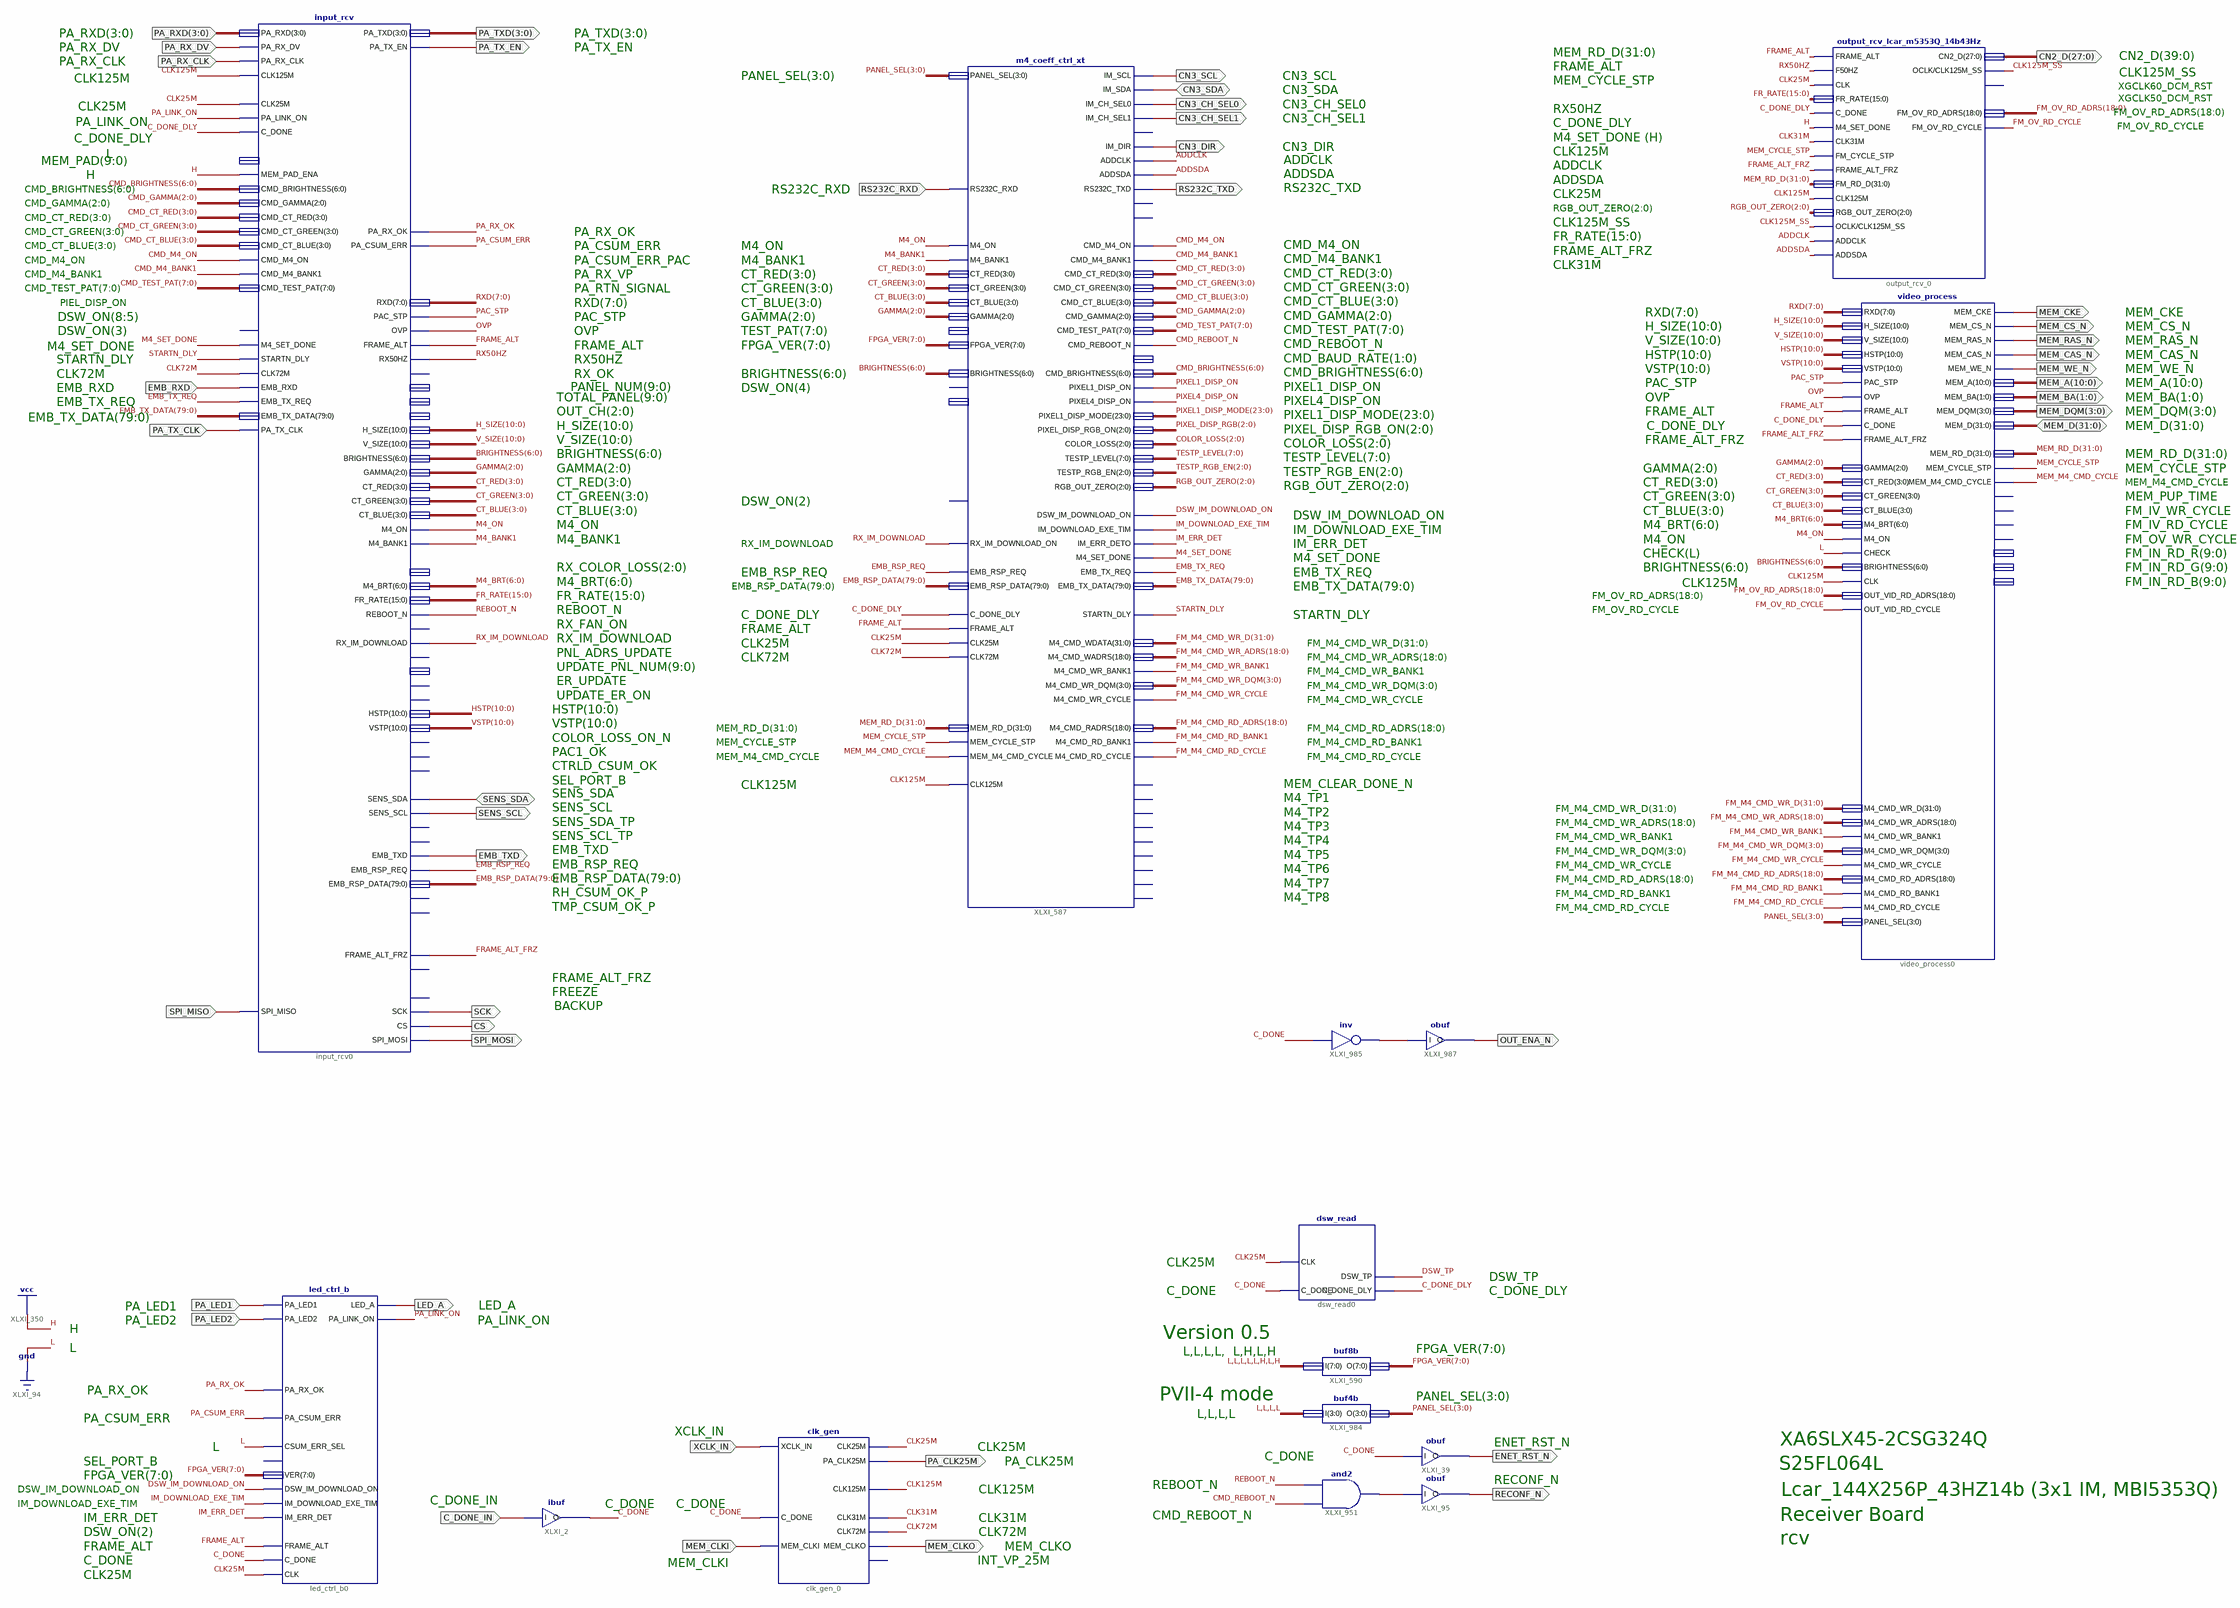
[diagram p0: schematic sheet 1]
// Xilinx ISE schematic rcv.sch (aspartan6) as structural Verilog: 15 symbols, 42 ports
module rcv (
  input  RS232C_RXD,
  input  MEM_CLKI,
  input  XCLK_IN,
  input  PA_LED1,
  input  PA_LED2,
  input  C_DONE_IN,
  input  PA_RX_DV,
  input  [3:0] PA_RXD,
  input  PA_RX_CLK,
  input  EMB_RXD,
  input  PA_TX_CLK,
  input  SPI_MISO,
  inout  CN3_SDA,
  inout  [31:0] MEM_D,
  inout  SENS_SDA,
  output CN3_CH_SEL1,
  output CN3_CH_SEL0,
  output CN3_SCL,
  output RS232C_TXD,
  output MEM_CS_N,
  output [3:0] MEM_DQM,
  output MEM_RAS_N,
  output MEM_CAS_N,
  output MEM_WE_N,
  output MEM_CKE,
  output [10:0] MEM_A,
  output [1:0] MEM_BA,
  output PA_CLK25M,
  output MEM_CLKO,
  output RECONF_N,
  output ENET_RST_N,
  output LED_A,
  output CN3_DIR,
  output [27:0] CN2_D,
  output [3:0] PA_TXD,
  output PA_TX_EN,
  output SENS_SCL,
  output EMB_TXD,
  output SCK,
  output CS,
  output SPI_MOSI,
  output OUT_ENA_N
);

  wire ADDCLK, ADDSDA, C_DONE, C_DONE_DLY, CLK25M, CLK31M, CLK72M, CLK125M, CLK125M_SS, CMD_M4_BANK1,
       CMD_M4_ON, CMD_REBOOT_N, DSW_IM_DOWNLOAD_ON, DSW_TP, EMB_RSP_REQ, EMB_TX_REQ, FM_M4_CMD_RD_BANK1,
       FM_M4_CMD_RD_CYCLE, FM_M4_CMD_WR_BANK1, FM_M4_CMD_WR_CYCLE, FM_OV_RD_CYCLE, FRAME_ALT, FRAME_ALT_FRZ,
       IM_DOWNLOAD_EXE_TIM, IM_ERR_DET, M4_BANK1, M4_ON, M4_SET_DONE, MEM_CYCLE_STP, MEM_M4_CMD_CYCLE, OVP,
       PA_CSUM_ERR, PA_LINK_ON, PA_RX_OK, PAC_STP, PIXEL1_DISP_ON, PIXEL4_DISP_ON, REBOOT_N, RX50HZ,
       RX_IM_DOWNLOAD, STARTN_DLY, XLXN_475, XLXN_477;
  wire [2:0] CMD_GAMMA, COLOR_LOSS, GAMMA, PIXEL_DISP_RGB, RGB_OUT_ZERO, TESTP_RGB_EN;
  wire [3:0] CMD_CT_BLUE, CMD_CT_GREEN, CMD_CT_RED, CT_BLUE, CT_GREEN, CT_RED, FM_M4_CMD_WR_DQM, PANEL_SEL;
  wire [6:0] BRIGHTNESS, CMD_BRIGHTNESS, M4_BRT;
  wire [7:0] CMD_TEST_PAT, FPGA_VER, RXD, TESTP_LEVEL;
  wire [10:0] H_SIZE, HSTP, V_SIZE, VSTP;
  wire [15:0] FR_RATE;
  wire [18:0] FM_M4_CMD_RD_ADRS, FM_M4_CMD_WR_ADRS, FM_OV_RD_ADRS;
  wire [23:0] PIXEL1_DISP_MODE;
  wire [31:0] FM_M4_CMD_WR_D, MEM_RD_D;
  wire [79:0] EMB_RSP_DATA, EMB_TX_DATA;

  clk_gen clk_gen_0 (
    .XCLK_IN(XCLK_IN), .C_DONE(C_DONE), .MEM_CLKI(MEM_CLKI), .CLK25M(CLK25M), .PA_CLK25M(PA_CLK25M),
    .CLK31M(CLK31M), .CLK125M(CLK125M), .MEM_CLKO(MEM_CLKO), .CLK72M(CLK72M));  // open: VP
  obuf XLXI_95 (.I(XLXN_475), .O(RECONF_N));
  and XLXI_951 (XLXN_475, CMD_REBOOT_N, REBOOT_N);
  obuf XLXI_39 (.I(C_DONE), .O(ENET_RST_N));
  buf8b XLXI_590 (.I(8'b00000101), .O(FPGA_VER));
  dsw_read dsw_read0 (.CLK(CLK25M), .C_DONE(C_DONE), .DSW_TP(DSW_TP), .C_DONE_DLY(C_DONE_DLY));
  ibuf XLXI_2 (.I(C_DONE_IN), .O(C_DONE));
  video_process video_process0 (
    .OVP(OVP), .CLK(CLK125M), .FRAME_ALT(FRAME_ALT), .RXD(RXD), .H_SIZE(H_SIZE), .V_SIZE(V_SIZE),
    .HSTP(HSTP), .VSTP(VSTP), .PAC_STP(PAC_STP), .C_DONE(C_DONE_DLY), .OUT_VID_RD_ADRS(FM_OV_RD_ADRS),
    .OUT_VID_RD_CYCLE(FM_OV_RD_CYCLE), .GAMMA(GAMMA), .CT_RED(CT_RED), .CT_GREEN(CT_GREEN),
    .CT_BLUE(CT_BLUE), .M4_BRT(M4_BRT), .M4_ON(M4_ON), .CHECK(1'b0), .M4_CMD_RD_CYCLE(FM_M4_CMD_RD_CYCLE),
    .M4_CMD_RD_BANK1(FM_M4_CMD_RD_BANK1), .M4_CMD_RD_ADRS(FM_M4_CMD_RD_ADRS),
    .M4_CMD_WR_CYCLE(FM_M4_CMD_WR_CYCLE), .M4_CMD_WR_DQM(FM_M4_CMD_WR_DQM),
    .M4_CMD_WR_BANK1(FM_M4_CMD_WR_BANK1), .M4_CMD_WR_ADRS(FM_M4_CMD_WR_ADRS), .M4_CMD_WR_D(FM_M4_CMD_WR_D),
    .FRAME_ALT_FRZ(FRAME_ALT_FRZ), .BRIGHTNESS(BRIGHTNESS), .MEM_D(MEM_D), .MEM_CKE(MEM_CKE),
    .MEM_CS_N(MEM_CS_N), .MEM_RAS_N(MEM_RAS_N), .MEM_CAS_N(MEM_CAS_N), .MEM_WE_N(MEM_WE_N),
    .MEM_DQM(MEM_DQM), .MEM_RD_D(MEM_RD_D), .MEM_BA(MEM_BA), .MEM_A(MEM_A),
    .MEM_M4_CMD_CYCLE(MEM_M4_CMD_CYCLE), .MEM_CYCLE_STP(MEM_CYCLE_STP), .PANEL_SEL(PANEL_SEL));  // open: PUP_TIME, FM_IV_WR_CYCLE, FM_IV_RD_CYCLE, FM_OV_WR_CYCLE, FM_IN_RD_G, FM_IN_RD_R, FM_IN_RD_B
  buf4b XLXI_984 (.I(4'b0000), .O(PANEL_SEL));
  m4_coeff_ctrl_xt XLXI_587 (
    .FRAME_ALT(FRAME_ALT), .CLK25M(CLK25M), .EMB_RSP_REQ(EMB_RSP_REQ), .EMB_RSP_DATA(EMB_RSP_DATA),
    .CLK72M(CLK72M), .RX_IM_DOWNLOAD_ON(RX_IM_DOWNLOAD), .M4_ON(M4_ON), .M4_BANK1(M4_BANK1), .CT_RED(CT_RED),
    .CT_GREEN(CT_GREEN), .CT_BLUE(CT_BLUE), .GAMMA(GAMMA), .FPGA_VER(FPGA_VER), .BRIGHTNESS(BRIGHTNESS),
    .RS232C_RXD(RS232C_RXD), .C_DONE_DLY(C_DONE_DLY), .PANEL_SEL(PANEL_SEL),
    .MEM_M4_CMD_CYCLE(MEM_M4_CMD_CYCLE), .MEM_CYCLE_STP(MEM_CYCLE_STP), .MEM_RD_D(MEM_RD_D),
    .CLK125M(CLK125M), .IM_SDA(CN3_SDA), .M4_SET_DONE(M4_SET_DONE), .DSW_IM_DOWNLOAD_ON(DSW_IM_DOWNLOAD_ON),
    .STARTN_DLY(STARTN_DLY), .RS232C_TXD(RS232C_TXD), .CMD_M4_ON(CMD_M4_ON), .CMD_M4_BANK1(CMD_M4_BANK1),
    .CMD_CT_RED(CMD_CT_RED), .CMD_CT_GREEN(CMD_CT_GREEN), .CMD_CT_BLUE(CMD_CT_BLUE), .CMD_GAMMA(CMD_GAMMA),
    .CMD_TEST_PAT(CMD_TEST_PAT), .CMD_REBOOT_N(CMD_REBOOT_N), .CMD_BRIGHTNESS(CMD_BRIGHTNESS),
    .PIXEL1_DISP_ON(PIXEL1_DISP_ON), .PIXEL4_DISP_ON(PIXEL4_DISP_ON), .PIXEL1_DISP_MODE(PIXEL1_DISP_MODE),
    .PIXEL_DISP_RGB_ON(PIXEL_DISP_RGB), .COLOR_LOSS(COLOR_LOSS), .TESTP_LEVEL(TESTP_LEVEL),
    .TESTP_RGB_EN(TESTP_RGB_EN), .RGB_OUT_ZERO(RGB_OUT_ZERO), .IM_DOWNLOAD_EXE_TIM(IM_DOWNLOAD_EXE_TIM),
    .EMB_TX_REQ(EMB_TX_REQ), .EMB_TX_DATA(EMB_TX_DATA), .IM_SCL(CN3_SCL), .IM_CH_SEL0(CN3_CH_SEL0),
    .IM_CH_SEL1(CN3_CH_SEL1), .M4_CMD_WR_CYCLE(FM_M4_CMD_WR_CYCLE), .M4_CMD_WDATA(FM_M4_CMD_WR_D),
    .M4_CMD_WADRS(FM_M4_CMD_WR_ADRS), .M4_CMD_WR_BANK1(FM_M4_CMD_WR_BANK1), .M4_CMD_WR_DQM(FM_M4_CMD_WR_DQM),
    .M4_CMD_RADRS(FM_M4_CMD_RD_ADRS), .M4_CMD_RD_BANK1(FM_M4_CMD_RD_BANK1),
    .M4_CMD_RD_CYCLE(FM_M4_CMD_RD_CYCLE), .IM_ERR_DETO(IM_ERR_DET), .ADDSDA(ADDSDA), .ADDCLK(ADDCLK),
    .IM_DIR(CN3_DIR));  // open: DSW_IM_DOWNLOAD_REQ, TEST_PAT, DSW_LOSS_BRT100, MEM_COLOR_LOSS, RS232C_RXD_A, RS232C_TXD_A, CMD_BAUD_RATE, MEM_CLEAR_DONE_N, TP1, TP2, TP3, TP6, TP7, TP8, TP4, TP5, IM_CH_SEL2
  led_ctrl_b led_ctrl_b0 (
    .DSW_IM_DOWNLOAD_ON(DSW_IM_DOWNLOAD_ON), .IM_DOWNLOAD_EXE_TIM(IM_DOWNLOAD_EXE_TIM),
    .IM_ERR_DET(IM_ERR_DET), .CLK(CLK25M), .C_DONE(C_DONE), .FRAME_ALT(FRAME_ALT), .VER(FPGA_VER),
    .CSUM_ERR_SEL(1'b0), .PA_RX_OK(PA_RX_OK), .PA_CSUM_ERR(PA_CSUM_ERR), .PA_LED1(PA_LED1),
    .PA_LED2(PA_LED2), .PA_LINK_ON(PA_LINK_ON), .LED_A(LED_A));  // open: SEL_PORT_B
  output_rcv_lcar_m5353Q_14b43Hz output_rcv_0 (
    .CLK(CLK25M), .ADDCLK(ADDCLK), .ADDSDA(ADDSDA), .FRAME_ALT(FRAME_ALT), .F50HZ(RX50HZ),
    .C_DONE(C_DONE_DLY), .M4_SET_DONE(1'b1), .CLK125M(CLK125M), .FM_CYCLE_STP(MEM_CYCLE_STP),
    .FM_RD_D(MEM_RD_D), .RGB_OUT_ZERO(RGB_OUT_ZERO), .OCLK(CLK125M_SS), .FR_RATE(FR_RATE),
    .FRAME_ALT_FRZ(FRAME_ALT_FRZ), .CLK31M(CLK31M), .CN2_D(CN2_D), .FM_OV_RD_ADRS(FM_OV_RD_ADRS),
    .FM_OV_RD_CYCLE(FM_OV_RD_CYCLE), .CLK125M_SS(CLK125M_SS));  // open: XGCLK60_DCM_RST
  input_rcv input_rcv0 (
    .CLK125M(CLK125M), .PA_LINK_ON(PA_LINK_ON), .C_DONE(C_DONE_DLY), .PA_RX_DV(PA_RX_DV), .CLK25M(CLK25M),
    .EMB_RXD(EMB_RXD), .EMB_TX_REQ(EMB_TX_REQ), .EMB_TX_DATA(EMB_TX_DATA), .STARTN_DLY(STARTN_DLY),
    .CLK72M(CLK72M), .CMD_BRIGHTNESS(CMD_BRIGHTNESS), .MEM_PAD_ENA(1'b1), .CMD_GAMMA(CMD_GAMMA),
    .CMD_CT_RED(CMD_CT_RED), .CMD_CT_GREEN(CMD_CT_GREEN), .CMD_CT_BLUE(CMD_CT_BLUE), .CMD_M4_ON(CMD_M4_ON),
    .CMD_M4_BANK1(CMD_M4_BANK1), .CMD_TEST_PAT(CMD_TEST_PAT), .M4_SET_DONE(M4_SET_DONE), .PA_RXD(PA_RXD),
    .PA_RX_CLK(PA_RX_CLK), .PA_TX_CLK(PA_TX_CLK), .SPI_MISO(SPI_MISO), .SENS_SDA(SENS_SDA),
    .PA_RX_OK(PA_RX_OK), .OVP(OVP), .FRAME_ALT(FRAME_ALT), .PA_TXD(PA_TXD), .PA_TX_EN(PA_TX_EN),
    .SENS_SCL(SENS_SCL), .EMB_TXD(EMB_TXD), .EMB_RSP_REQ(EMB_RSP_REQ), .EMB_RSP_DATA(EMB_RSP_DATA),
    .RXD(RXD), .PAC_STP(PAC_STP), .REBOOT_N(REBOOT_N), .RX_IM_DOWNLOAD(RX_IM_DOWNLOAD), .HSTP(HSTP),
    .VSTP(VSTP), .RX50HZ(RX50HZ), .H_SIZE(H_SIZE), .V_SIZE(V_SIZE), .BRIGHTNESS(BRIGHTNESS), .GAMMA(GAMMA),
    .CT_RED(CT_RED), .CT_GREEN(CT_GREEN), .CT_BLUE(CT_BLUE), .M4_ON(M4_ON), .M4_BANK1(M4_BANK1),
    .M4_BRT(M4_BRT), .FR_RATE(FR_RATE), .FRAME_ALT_FRZ(FRAME_ALT_FRZ), .PA_CSUM_ERR(PA_CSUM_ERR), .SCK(SCK),
    .CS(CS), .SPI_MOSI(SPI_MOSI));  // open: MEM_PAD, DSW_PAD_UPDATE, PANEL_NUM, RX_FAN_ON, SENS_SCL_TP, SENS_SDA_TP, TMP_CSUM_OK_P, RH_CSUM_OK_P, UPDATE_PNL_NUM, PNL_ADRS_UPDATE, ER_UPDATE, UPDATE_ER_ON, COLOR_LOSS_ON_N, RX_OK, PAC1_OK, CTRLD_CSUM_OK, TOTAL_PANEL, OUT_CH, COLOR_LOSS, FREEZE, L
  not XLXI_985 (XLXN_477, C_DONE);
  obuf XLXI_987 (.I(XLXN_477), .O(OUT_ENA_N));

  // Notes on the sheet:
  //   PA_RXD(3:0)
  //   PA_TXD(3:0)
  //   PA_RX_DV
  //   PA_TX_EN
  //   MEM_RD_D(31:0)
  //   CN2_D(39:0)
  //   PA_RX_CLK
  //   FRAME_ALT
  //   CLK125M_SS
  //   PANEL_SEL(3:0)
  //   CN3_SCL
  //   CLK125M
  //   MEM_CYCLE_STP
  //   XGCLK60_DCM_RST
  //   CN3_SDA
  //   XGCLK50_DCM_RST
  //   CN3_CH_SEL0
  //   CLK25M
  //   RX50HZ
  //   FM_OV_RD_ADRS(18:0)
  //   CN3_CH_SEL1
  //   PA_LINK_ON
  //   C_DONE_DLY
  //   FM_OV_RD_CYCLE
  //   M4_SET_DONE (H)
  //   C_DONE_DLY
  //   CN3_DIR
  //   CLK125M
  //   L
  //   ADDCLK
  //   MEM_PAD(9:0)
  //   ADDCLK
  //   ADDSDA
  //   H
  //   ADDSDA
  //   RS232C_TXD
  //   CMD_BRIGHTNESS(6:0)
  //   RS232C_RXD
  //   CLK25M
  //   CMD_GAMMA(2:0)
  //   RGB_OUT_ZERO(2:0)
  //   CMD_CT_RED(3:0)
  //   CLK125M_SS
  //   CMD_CT_GREEN(3:0)
  //   PA_RX_OK
  //   FR_RATE(15:0)
  //   CMD_M4_ON
  //   CMD_CT_BLUE(3:0)
  //   PA_CSUM_ERR
  //   M4_ON
  //   FRAME_ALT_FRZ
  //   CMD_M4_BANK1
  //   CMD_M4_ON
  //   PA_CSUM_ERR_PAC
  //   M4_BANK1
  //   CLK31M
  //   CMD_CT_RED(3:0)
  //   CMD_M4_BANK1
  //   PA_RX_VP
  //   CT_RED(3:0)
  //   CMD_CT_GREEN(3:0)
  //   CMD_TEST_PAT(7:0)
  //   PA_RTN_SIGNAL
  //   CT_GREEN(3:0)
  //   CMD_CT_BLUE(3:0)
  //   PIEL_DISP_ON
  //   RXD(7:0)
  //   CT_BLUE(3:0)
  //   RXD(7:0)
  //   MEM_CKE
  //   CMD_GAMMA(2:0)
  //   DSW_ON(8:5)
  //   PAC_STP
  //   GAMMA(2:0)
  //   H_SIZE(10:0)
  //   MEM_CS_N
  //   CMD_TEST_PAT(7:0)
  //   DSW_ON(3)
  //   OVP
  //   TEST_PAT(7:0)
  //   V_SIZE(10:0)
  //   MEM_RAS_N
  //   CMD_REBOOT_N
  //   FRAME_ALT
  //   FPGA_VER(7:0)
  //   M4_SET_DONE
  //   HSTP(10:0)
  //   MEM_CAS_N
  //   CMD_BAUD_RATE(1:0)
  //   STARTN_DLY
  //   RX50HZ
  //   VSTP(10:0)
  //   MEM_WE_N
  //   CMD_BRIGHTNESS(6:0)
  //   CLK72M
  //   RX_OK
  //   BRIGHTNESS(6:0)
  //   PAC_STP
  //   MEM_A(10:0)
  //   PANEL_NUM(9:0)
  //   PIXEL1_DISP_ON
  //   EMB_RXD
  //   DSW_ON(4)
  //   TOTAL_PANEL(9:0)
  //   OVP
  //   MEM_BA(1:0)
  //   PIXEL4_DISP_ON
  //   EMB_TX_REQ
  //   OUT_CH(2:0)
  //   FRAME_ALT
  //   MEM_DQM(3:0)
  //   PIXEL1_DISP_MODE(23:0)
  //   EMB_TX_DATA(79:0)
  //   H_SIZE(10:0)
  //   C_DONE_DLY
  //   MEM_D(31:0)
  //   PIXEL_DISP_RGB_ON(2:0)
  //   V_SIZE(10:0)
  //   FRAME_ALT_FRZ
  //   COLOR_LOSS(2:0)
  //   BRIGHTNESS(6:0)
  //   MEM_RD_D(31:0)
  //   TESTP_LEVEL(7:0)
  //   GAMMA(2:0)
  //   GAMMA(2:0)
  //   MEM_CYCLE_STP
  //   TESTP_RGB_EN(2:0)
  //   CT_RED(3:0)
  //   CT_RED(3:0)
  //   MEM_M4_CMD_CYCLE
  //   RGB_OUT_ZERO(2:0)
  //   CT_GREEN(3:0)
  //   CT_GREEN(3:0)
  //   MEM_PUP_TIME
  //   DSW_ON(2)
  //   CT_BLUE(3:0)
  //   CT_BLUE(3:0)
  //   FM_IV_WR_CYCLE
  //   DSW_IM_DOWNLOAD_ON
  //   M4_ON
  //   M4_BRT(6:0)
  //   FM_IV_RD_CYCLE
  //   IM_DOWNLOAD_EXE_TIM
  //   M4_BANK1
  //   M4_ON
  //   FM_OV_WR_CYCLE
  //   RX_IM_DOWNLOAD
  //   IM_ERR_DET
  //   CHECK(L)
  //   FM_IN_RD_R(9:0)
  //   M4_SET_DONE
  //   RX_COLOR_LOSS(2:0)
  //   BRIGHTNESS(6:0)
  //   FM_IN_RD_G(9:0)
  //   EMB_RSP_REQ
  //   EMB_TX_REQ
  //   M4_BRT(6:0)
  //   FM_IN_RD_B(9:0)
  //   CLK125M
  //   EMB_RSP_DATA(79:0)
  //   EMB_TX_DATA(79:0)
  //   FR_RATE(15:0)
  //   FM_OV_RD_ADRS(18:0)
  //   REBOOT_N
  //   FM_OV_RD_CYCLE
  //   C_DONE_DLY
  //   STARTN_DLY
  //   RX_FAN_ON
  //   FRAME_ALT
  //   RX_IM_DOWNLOAD
  //   CLK25M
  //   FM_M4_CMD_WR_D(31:0)
  //   PNL_ADRS_UPDATE
  //   CLK72M
  //   FM_M4_CMD_WR_ADRS(18:0)
  //   UPDATE_PNL_NUM(9:0)
  //   FM_M4_CMD_WR_BANK1
  //   ER_UPDATE
  //   FM_M4_CMD_WR_DQM(3:0)
  //   UPDATE_ER_ON
  //   FM_M4_CMD_WR_CYCLE
  //   HSTP(10:0)
  //   VSTP(10:0)
  //   MEM_RD_D(31:0)
  //   FM_M4_CMD_RD_ADRS(18:0)
  //   COLOR_LOSS_ON_N
  //   MEM_CYCLE_STP
  //   FM_M4_CMD_RD_BANK1
  //   PAC1_OK
  //   MEM_M4_CMD_CYCLE
  //   FM_M4_CMD_RD_CYCLE
  //   CTRLD_CSUM_OK
  //   SEL_PORT_B
  //   MEM_CLEAR_DONE_N
  //   CLK125M
  //   SENS_SDA
  //   M4_TP1
  //   SENS_SCL
  //   FM_M4_CMD_WR_D(31:0)
  //   M4_TP2
  //   SENS_SDA_TP
  //   FM_M4_CMD_WR_ADRS(18:0)
  //   M4_TP3
  //   SENS_SCL_TP
  //   FM_M4_CMD_WR_BANK1
  //   M4_TP4
  //   EMB_TXD
  //   FM_M4_CMD_WR_DQM(3:0)
  //   M4_TP5
  //   EMB_RSP_REQ
  //   FM_M4_CMD_WR_CYCLE
  //   M4_TP6
  //   EMB_RSP_DATA(79:0)
  //   FM_M4_CMD_RD_ADRS(18:0)
  //   M4_TP7
  //   RH_CSUM_OK_P
  //   FM_M4_CMD_RD_BANK1
  //   M4_TP8
  //   TMP_CSUM_OK_P
  //   FM_M4_CMD_RD_CYCLE
  //   FRAME_ALT_FRZ
  //   FREEZE
  //   BACKUP
  //   CLK25M
  //   DSW_TP
  //   C_DONE
  //   C_DONE_DLY
  //   LED_A
  //   PA_LED1
  //   PA_LED2
  //   PA_LINK_ON
  //   H
  //   Version 0.5
  //   L
  //   FPGA_VER(7:0)
  //   L,L,L,L,  L,H,L,H
  //   PA_RX_OK
  //   PVII-4 mode
  //   PANEL_SEL(3:0)
  //   L,L,L,L
  //   PA_CSUM_ERR
  //   XCLK_IN
  //   XA6SLX45-2CSG324Q
  //   ENET_RST_N
  //   L
  //   CLK25M
  //   C_DONE
  //   SEL_PORT_B
  //   PA_CLK25M
  //   S25FL064L
  //   FPGA_VER(7:0)
  //   RECONF_N
  //   REBOOT_N
  //   DSW_IM_DOWNLOAD_ON
  //   CLK125M
  //   Lcar_144X256P_43HZ14b (3x1 IM, MBI5353Q)
  //   C_DONE_IN
  //   IM_DOWNLOAD_EXE_TIM
  //   C_DONE
  //   C_DONE
  //   Receiver Board
  //   CMD_REBOOT_N
  //   IM_ERR_DET
  //   CLK31M
  //   DSW_ON(2)
  //   CLK72M
  //   rcv
  //   FRAME_ALT
  //   MEM_CLKO
  //   C_DONE
  //   INT_VP_25M
  //   MEM_CLKI
  //   CLK25M
endmodule
